# Altium schematic sheet 電源分接.SchDoc
size A4
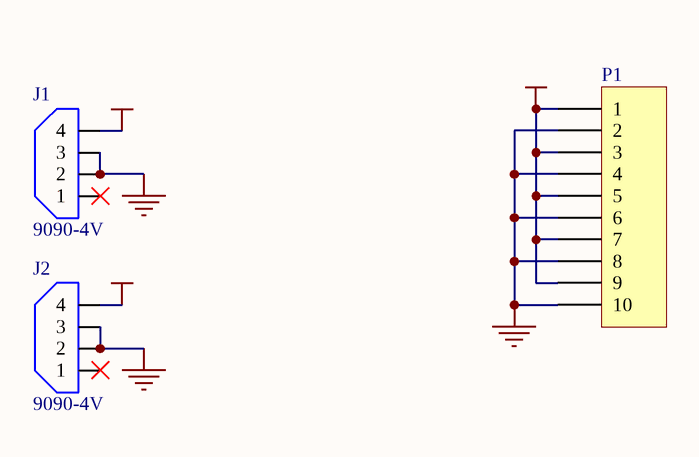
[diagram p0: 電源分接.SchDoc]

## Parts
J1  9090-4V  [9090-4V]
J2  9090-4V  [9090-4V]
P1  Header 10  [10pin 3.96mm]  (value not drawn)

## Nets
+12: J1.4 J2.4 P1.1 P1.3 P1.5 P1.7 P1.9
GND: J1.2 J1.3 J2.2 J2.3 P1.2 P1.4 P1.6 P1.8 P1.10

Not connected (* = marked no-connect by the designer): J1 1*; J2 1*

## Library data of the parts
P1 = Header 10: Header, 10-Pin; LatestRevisionDate: 17-Jul-2002; LatestRevisionNote: Re-released for DXP Platform.; Publisher: Altium Limited